# Altium project FPGA_Nixie_Clock.PrjPcb
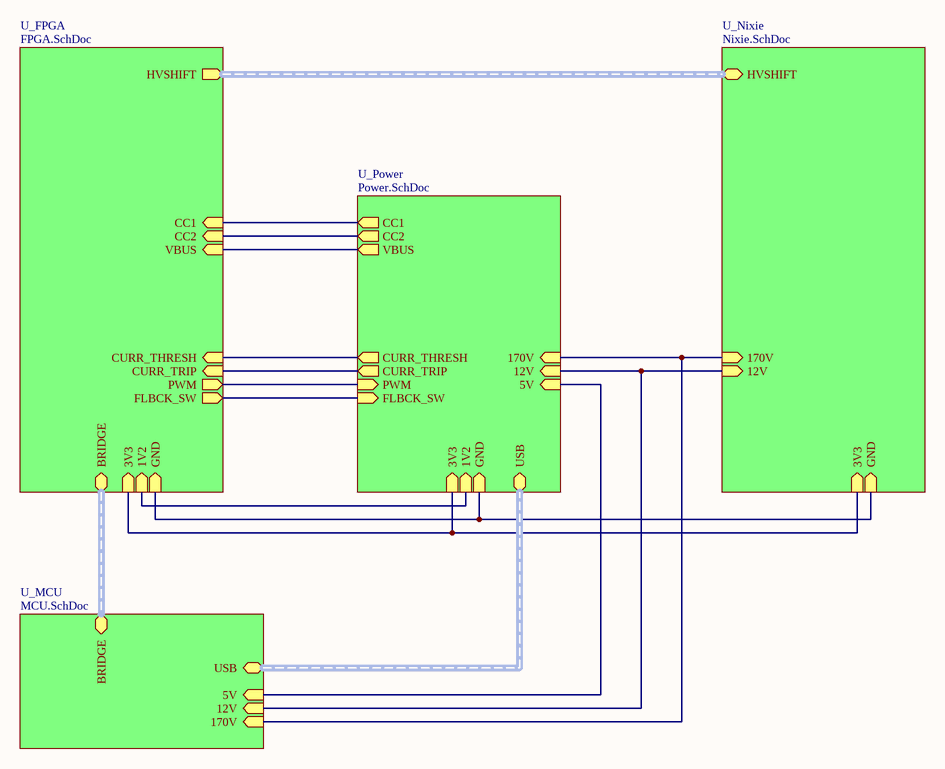
[diagram p0: Top Sheet.SchDoc]
5 sheets, 171 parts. Net scope: hierarchical (ports join the sheet entries above them; power ports are global).
Board file: FPGA_Nixie_Clock.PcbDoc
Sheets:
  Top Sheet.SchDoc
    U_FPGA = FPGA.SchDoc
    U_Power = Power.SchDoc
    U_Nixie = Nixie.SchDoc
    U_MCU = MCU.SchDoc

## Sheet Top Sheet.SchDoc
size A; SheetNumber: 1; SheetTotal: 5

### Sub-sheets
U_FPGA = FPGA.SchDoc: 3V3 (in), GND (in), 1V2 (in), BRIDGE (bidir), FLBCK_SW (out), HVSHIFT (out), CC2 (in), CC1 (in), VBUS (in), CURR_TRIP (in), CURR_THRESH (in), PWM (out)
U_MCU = MCU.SchDoc: BRIDGE (bidir), USB (bidir), 170V (in), 12V (in), 5V (in)
U_Nixie = Nixie.SchDoc: 170V (in), 12V (in), GND (in), 3V3 (in), HVSHIFT (bidir)
U_Power = Power.SchDoc: 3V3 (in), GND (in), 1V2 (in), 170V (in), CURR_TRIP (out), CURR_THRESH (out), PWM (in), 12V (in), USB (bidir), 5V (in), CC2 (out), CC1 (out), VBUS (out), FLBCK_SW (in)

### Nets
3V3: sheet U_FPGA/3V3, sheet U_Power/3V3, sheet U_Nixie/3V3
12V: sheet U_Power/12V, sheet U_Nixie/12V, sheet U_MCU/12V
GND: sheet U_FPGA/GND, sheet U_Power/GND, sheet U_Nixie/GND
VCC_1: sheet U_FPGA/1V2, sheet U_Power/1V2
CC1: sheet U_FPGA/CC1, sheet U_Power/CC1
CC2: sheet U_FPGA/CC2, sheet U_Power/CC2
VBUS: sheet U_FPGA/VBUS, sheet U_Power/5V, sheet U_Power/VBUS, sheet U_MCU/5V
NetC33_2: sheet U_Power/170V, sheet U_Nixie/170V, sheet U_MCU/170V
NetR27_2: sheet U_FPGA/FLBCK_SW, sheet U_Power/FLBCK_SW
NetR35_1: sheet U_FPGA/CURR_THRESH, sheet U_Power/CURR_THRESH
NetU1_45: sheet U_FPGA/PWM, sheet U_Power/PWM
NetU1_48: sheet U_FPGA/CURR_TRIP, sheet U_Power/CURR_TRIP

### Buses and harness runs
harness sheet U_FPGA/BRIDGE = sheet U_MCU/BRIDGE
harness sheet U_FPGA/HVSHIFT = sheet U_Nixie/HVSHIFT
harness sheet U_MCU/USB = sheet U_Power/USB

## Sheet FPGA.SchDoc
size B; SheetNumber: 2; SheetTotal: 5
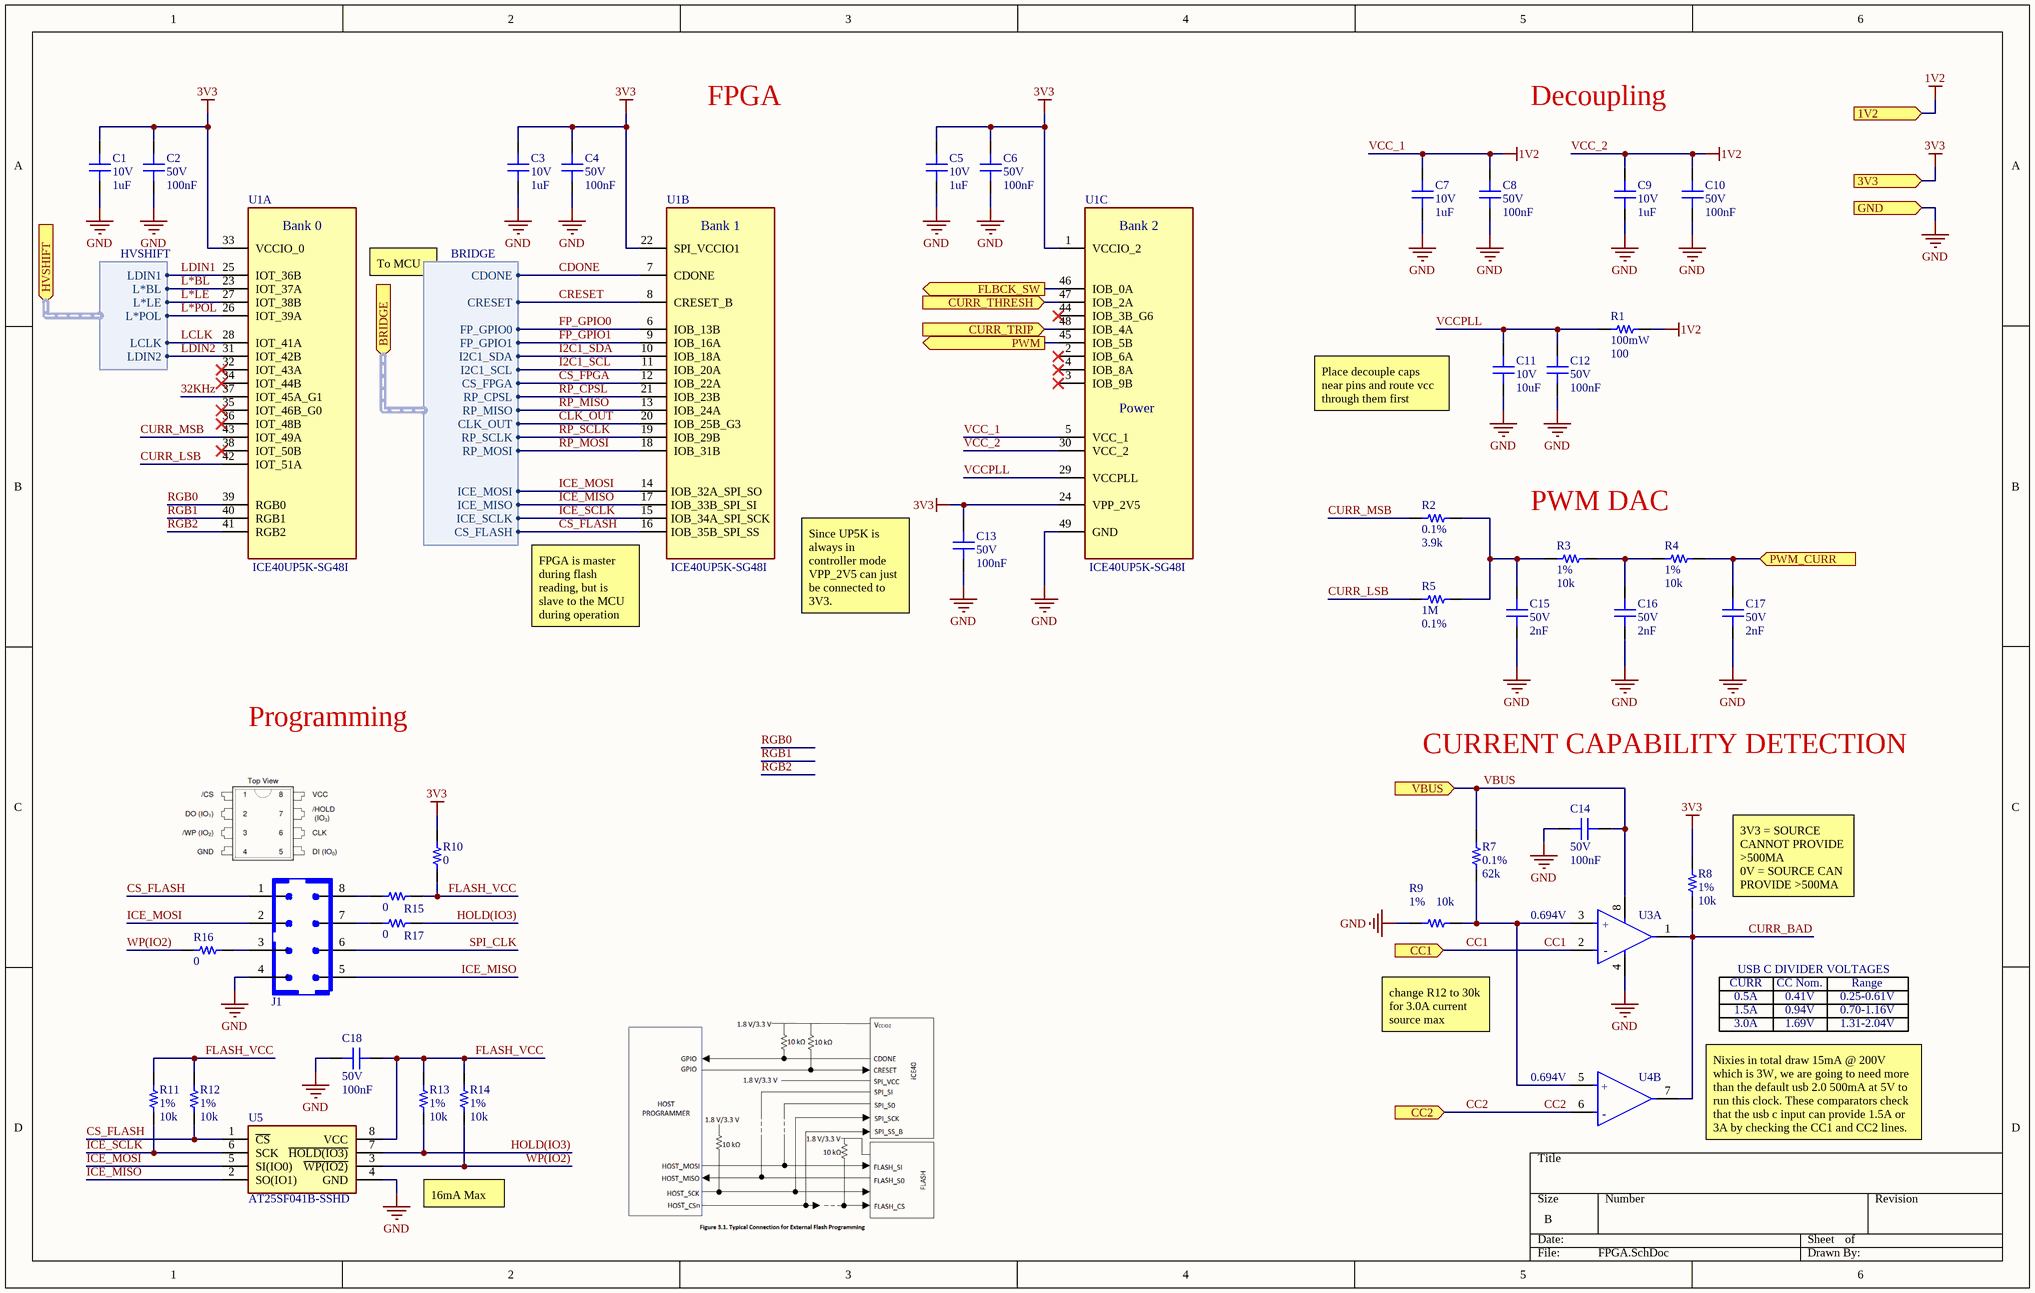
[diagram p1: FPGA.SchDoc]

### Parts
(Parts that share a designator on the sheet are numbered #1, #2 ... from top to bottom, then left to right.)
C1  Voltage Rating: 10V  Capacitance: 1uF  [0603]  (hidden comment: CL10B105KP8NFNC)
C2  Voltage Rating: 50V  Capacitance: 100nF  [0603]  (hidden comment: MT18B104K500CT)
C3  Voltage Rating: 10V  Capacitance: 1uF  [0603]  (hidden comment: CL10B105KP8NFNC)
C4  Voltage Rating: 50V  Capacitance: 100nF  [0603]  (hidden comment: MT18B104K500CT)
C5  Voltage Rating: 10V  Capacitance: 1uF  [0603]  (hidden comment: CL10B105KP8NFNC)
C6  Voltage Rating: 50V  Capacitance: 100nF  [0603]  (hidden comment: MT18B104K500CT)
C7  Voltage Rating: 10V  Capacitance: 1uF  [0603]  (hidden comment: CL10B105KP8NFNC)
C8  Voltage Rating: 50V  Capacitance: 100nF  [0603]  (hidden comment: MT18B104K500CT)
C9  Voltage Rating: 10V  Capacitance: 1uF  [0603]  (hidden comment: CL10B105KP8NFNC)
C10  Voltage Rating: 50V  Capacitance: 100nF  [0603]  (hidden comment: MT18B104K500CT)
C11  Voltage Rating: 10V  Capacitance: 10uF  [0603]  (hidden comment: 0603X106M100CT)
C12  Voltage Rating: 50V  Capacitance: 100nF  [0603]  (hidden comment: MT18B104K500CT)
C13  Voltage Rating: 50V  Capacitance: 100nF  [0603]  (hidden comment: MT18B104K500CT)
C14  Voltage Rating: 50V  Capacitance: 100nF  [0603]  (hidden comment: MT18B104K500CT)
C15  Voltage Rating: 50V  Capacitance: 2nF  [0603]  (hidden comment: GRM1885C1H202JA01D)
C16  Voltage Rating: 50V  Capacitance: 2nF  [0603]  (hidden comment: GRM1885C1H202JA01D)
C17  Voltage Rating: 50V  Capacitance: 2nF  [0603]  (hidden comment: GRM1885C1H202JA01D)
C18  Voltage Rating: 50V  Capacitance: 100nF  [0603]  (hidden comment: MT18B104K500CT)
J1  IDC 2x4 2.54mm DC3-8P  [2.54mm Pitch 1.1mm Drill 2x4P]  (value not drawn)
R1  Power Rating: 100mW  Resistance: 100  [0603]  (hidden comment: CRG0603F100R)
R2  Tolerance: 0.1%  Resistance: 3.9k  [0603]  (hidden comment: CPF0603B3K9E1)
R3  Tolerance: 1%  Resistance: 10k  [0603]  (hidden comment: CRG0603F10K)
R4  Tolerance: 1%  Resistance: 10k  [0603]  (hidden comment: CRG0603F10K)
R5  Resistance: 1M  Tolerance: 0.1%  [0603]  (hidden comment: CPF0603B1M0E)
R7  Tolerance: 0.1%  Resistance: 62k  [0603]  (hidden comment: CPF0603B62KE1)
R8  Tolerance: 1%  Resistance: 10k  [0603]  (hidden comment: CRG0603F10K)
R9  Tolerance: 1%  Resistance: 10k  [0603]  (hidden comment: CRG0603F10K)
R10  Resistance: 0  [0603]  (hidden comment: RC0603JR-070RL)
R11  Tolerance: 1%  Resistance: 10k  [0603]  (hidden comment: CRG0603F10K)
R12  Tolerance: 1%  Resistance: 10k  [0603]  (hidden comment: CRG0603F10K)
R13  Tolerance: 1%  Resistance: 10k  [0603]  (hidden comment: CRG0603F10K)
R14  Tolerance: 1%  Resistance: 10k  [0603]  (hidden comment: CRG0603F10K)
R15  Resistance: 0  [0603]  (hidden comment: RC0603JR-070RL)
R16  Resistance: 0  [0603]  (hidden comment: RC0603JR-070RL)
R17  Resistance: 0  [0603]  (hidden comment: RC0603JR-070RL)
U1  ICE40UP5K-SG48I  [QFN-48]  (parts A,B,C of 3)
U3#1  LM393DR2G  [SOIC-8]  (value not drawn)  (part A of 2)
U4  LM393DR2G  [SOIC-8]  (value not drawn)  (part B of 2)
U5  AT25SF041B-SSHD  [SOIC-8]

### Ports
1V2 (in, see Top Sheet[1C], Power[6B]), 3V3 (in, see Top Sheet[1C], Nixie[1A], Power[6A]), BRIDGE (in, harness BRIDGE, see Top Sheet[1C], MCU[3B]), CC1 (in, see Top Sheet[2A], Power[2A]), CC2 (in, see Top Sheet[2B], Power[2B]), CURR_THRESH (in, see Top Sheet[2B], Power[4D]), CURR_TRIP (in, see Top Sheet[2B], Power[5D]), FLBCK_SW (out, see Top Sheet[2B], Power[1C]), GND (in, see Top Sheet[1C], Nixie[1A], Power[1D]), HVSHIFT (in, harness HVSHIFT, see Top Sheet[2A], Nixie[1C]), PWM (out, see Top Sheet[2B], Power[2D]), PWM_CURR (in), VBUS (in, see Top Sheet[2B], Power[4A])

### Harnesses
BRIDGE: CS_FLASH, ICE_SCLK, ICE_MOSI, ICE_MISO, CDONE, CRESET, CS_FPGA, RP_SCLK, RP_MOSI, RP_MISO, RP_CPSL, CLK_OUT, FP_GPIO1, FP_GPIO0, I2C1_SCL, I2C1_SDA
HVSHIFT: LDIN1, L*BL, L*LE, L*POL, LCLK, LDIN2

### Nets
3V3: C1.2 C2.2 C3.2 C4.2 C5.2 C6.2 C13.2 R8.2 R10.2 U1.1(VCCIO_2) U1.22(SPI_VCCIO1) U1.24(VPP_2V5) U1.33(VCCIO_0) ; port 3V3
GND: C1.1 C2.1 C3.1 C4.1 C5.1 C6.1 C7.1 C8.1 C9.1 C10.1 C11.1 C12.1 C13.1 C14.2 C15.1 C16.1 C17.1 C18.2 J1.4 R9.1 U1.49(GND) U3#1.4(GND) U5.4(GND) ; port GND
VCC_1: C7.2 C8.2 C9.2 C10.2 R1.2 U1.5(VCC_1) U1.30(VCC_2) ; port 1V2  [also labelled 1V2, VCC_2]
32KHz: U1.37(IOT_45A_G1)
CC1: U3#1.2(IN1-) ; port CC1
CC2: U4.6(IN2-) ; port CC2
CDONE: U1.7(CDONE) ; port BRIDGE.CDONE
CLK_OUT: U1.20(IOB_25B_G3) ; port BRIDGE.CLK_OUT  [project net CLK_GPOUT0]
CRESET: U1.8(CRESET_B) ; port BRIDGE.CRESET
CS_FLASH: J1.1 R12.1 U1.16(IOB_35B_SPI_SS) U5.1(~{CS}) ; port BRIDGE.CS_FLASH
CS_FPGA: U1.12(IOB_22A) ; port BRIDGE.CS_FPGA
CURR_BAD: R8.1 U3#1.1(OUT1) U4.7(OUT2)
CURR_LSB: R5.1 U1.42(IOT_51A)
CURR_MSB: R2.1 U1.43(IOT_49A)
FLASH_VCC: C18.1 R10.1 R11.2 R12.2 R13.2 R14.2 R15.2 U5.8(VCC)
FP_GPIO0: U1.6(IOB_13B) ; port BRIDGE.FP_GPIO0
FP_GPIO1: U1.9(IOB_16A) ; port BRIDGE.FP_GPIO1
HOLD(IO3): R13.1 R17.2 U5.7(~{HOLD(IO3)})
I2C1_SCL: U1.11(IOB_20A) ; port BRIDGE.I2C1_SCL
I2C1_SDA: U1.10(IOB_18A) ; port BRIDGE.I2C1_SDA
ICE_MISO: J1.5 U1.17(IOB_33B_SPI_SI) U5.2(SO(IO1)) ; port BRIDGE.ICE_MISO
ICE_MOSI: J1.2 U1.14(IOB_32A_SPI_SO) U5.5(SI(IO0)) ; port BRIDGE.ICE_MOSI
ICE_SCLK: R11.1 U1.15(IOB_34A_SPI_SCK) U5.6(SCK) ; port BRIDGE.ICE_SCLK
L*BL: U1.23(IOT_37A) ; port HVSHIFT.L*BL
L*LE: U1.27(IOT_38B) ; port HVSHIFT.L*LE
L*POL: U1.26(IOT_39A) ; port HVSHIFT.L*POL
LCLK: U1.28(IOT_41A) ; port HVSHIFT.LCLK
LDIN1: U1.25(IOT_36B) ; port HVSHIFT.LDIN1
LDIN2: U1.31(IOT_42B) ; port HVSHIFT.LDIN2
RGB0: U1.39(RGB0)
RGB1: U1.40(RGB1)
RGB2: U1.41(RGB2)
RP_CPSL: U1.21(IOB_23B) ; port BRIDGE.RP_CPSL
RP_MISO: U1.13(IOB_24A) ; port BRIDGE.RP_MISO
RP_MOSI: U1.18(IOB_31B) ; port BRIDGE.RP_MOSI
RP_SCLK: U1.19(IOB_29B) ; port BRIDGE.RP_SCLK
SPI_CLK: J1.6
VBUS: C14.1 R7.2 U3#1.8(V+) ; port VBUS
VCCPLL: C11.2 C12.2 R1.1 U1.29(VCCPLL)
WP(IO2): R14.1 R16.1 U5.3(~{WP(IO2)})
NetC15_2: C15.2 R2.2 R3.2 R5.2
NetC16_2: C16.2 R3.1 R4.2
NetC17_2: C17.2 R4.1 ; port PWM_CURR
NetJ1_3: J1.3 R16.2
NetJ1_7: J1.7 R17.1
NetJ1_8: J1.8 R15.1
NetR7_1: R7.1 R9.2 U3#1.3(IN1+) U4.5(IN2+)
NetR27_2: U1.46(IOB_0A) ; port FLBCK_SW
NetR35_1: U1.47(IOB_2A) ; port CURR_THRESH
NetU1_45: U1.45(IOB_5B) ; port PWM
NetU1_48: U1.48(IOB_4A) ; port CURR_TRIP

Not connected (* = marked no-connect by the designer): U1 2(IOB_6A)* 3(IOB_9B)* 4(IOB_8A)* 32(IOT_43A)* 34(IOT_44B)* 35(IOT_46B_G0)* 36(IOT_48B)* 38(IOT_50B)* 44(IOB_3B_G6)*

### Notes on the sheet
- FPGA
- Decoupling
- To MCU
- Place decouple caps near pins and route vcc through them first
- PWM DAC
- (near U1) FPGA is master during flash reading, but is slave to the MCU during operation
- Since UP5K is always in controller mode VPP_2V5 can just be connected to 3V3.
- Programming
- CURRENT CAPABILITY DETECTION
- (near R8) 3V3 = SOURCE CANNOT PROVIDE >500MA
  0V = SOURCE CAN PROVIDE >500MA
- (near U3#1) 0.694V
- USB C DIVIDER VOLTAGES
- change R12 to 30k for 3.0A current source max
- CURR
- 0.5A
- 1.5A
- 3.0A
- CC Nom.
- 0.41V
- 0.94V
- 1.69V
- Range
- 0.25-0.61V
- 0.70-1.16V
- 1.31-2.04V
- (near U4) 0.694V
- Nixies in total draw 15mA @ 200V which is 3W, we are going to need more than the default usb 2.0 500mA at 5V to run this clock. These comparators check that the usb c input can provide 1.5A or 3A by checking the CC1 and CC2 lines.
- 16mA Max
- (in symbol ICE40UP5K-SG48I, part A) Bank 0
- (in symbol ICE40UP5K-SG48I, part B) Bank 1
- (in symbol ICE40UP5K-SG48I, part C) Bank 2; Power
- (in symbol LM393DR2G, part A) +; -
- (in symbol LM393DR2G, part B) +; -

### Library data of the parts
C1 C3 C5 C7 C9 = CL10B105KP8NFNC: 1 µF ±10% 10V Ceramic Capacitor X7R 0603 (1608 Metric); Dielectric: X7R; Tolerance: 10%
C2 C4 C6 C8 C10 C12-C14 C18 = MT18B104K500CT: 0.1 µF ±10% 50V Ceramic Capacitor X7R 0603 (1608 Metric); Dielectric: X7R; Tolerance: 10%
C11 = 0603X106M100CT: 10 µF ±20% 10V Ceramic Capacitor X5R 0603 (1608 Metric); Dielectric: X5R; Tolerance: 20%
C15-C17 = GRM1885C1H202JA01D: 2000 pF ±5% 50V Ceramic Capacitor C0G, NP0 0603 (1608 Metric); Dielectric: C0G (NP0); Tolerance: 5%
J1 = IDC 2x4 2.54mm DC3-8P: Straight idc box headers PCB CONNECTOR DOUBLE ROW DC3 HEADER; M/F: Male; Rows: 2; Pins: 8; Pitch: 2.54mm
R1 = CRG0603F100R: 100 Ohms ±1% 0.1W, 1/10W Chip Resistor 0603 (1608 Metric) Thick Film; Temperature Coefficient: 100ppm/c; Tolerance: 1%; Case Code: 0603
R2 = CPF0603B3K9E1: 3.9 kOhms ±0.1% 0.063W, 1/16W Chip Resistor 0603 (1608 Metric) Thin Film; Power Rating: 62.5mW; Temperature Coefficient: 25ppm/c; Case Code: 0603
R3 R4 R8 R9 R11-R14 = CRG0603F10K: 10 kOhms ±1% 0.1W, 1/10W Chip Resistor 0603 (1608 Metric) Thick Film; Power Rating: 100mW; Temperature Coefficient: 100ppm/c; Case Code: 0603
R5 = CPF0603B1M0E: 1 MOhms ±0.1% 0.063W, 1/16W Chip Resistor 0603 (1608 Metric) Thin Film; Power Rating: 62.5mW; Temperature Coefficient: 25ppm/c; Case Code: 0603
R7 = CPF0603B62KE1: 62 kOhms ±0.1% 0.063W, 1/16W Chip Resistor 0603 (1608 Metric) Thin Film; Power Rating: 62.5mW; Temperature Coefficient: 25ppm/c; Case Code: 0603
R10 R15-R17 = RC0603JR-070RL: 0 Ohms Jumper 0.1W, 1/10W Chip Resistor 0603 (1608 Metric) Moisture Resistant Thick Film; Temperature Coefficient: 0ppm/c; Tolerance: 0%; Power Rating: 100mW; Case Code: 0603
U1 = ICE40UP5K-SG48I: FPGA - Field Programmable Gate Array iCE40-UltraPlus, 5280 LUTs, 1.2V
U3#1 U4 = LM393DR2G: Comparator Standard (General Purpose) Open-Collector, Rail-to-Rail 8-SOIC
U5 = AT25SF041B-SSHD: FLASH - NOR Memory IC 4Mbit SPI - Quad I/O 108 MHz 8-SOIC

## Sheet Power.SchDoc
size B; SheetNumber: 3; SheetTotal: 5
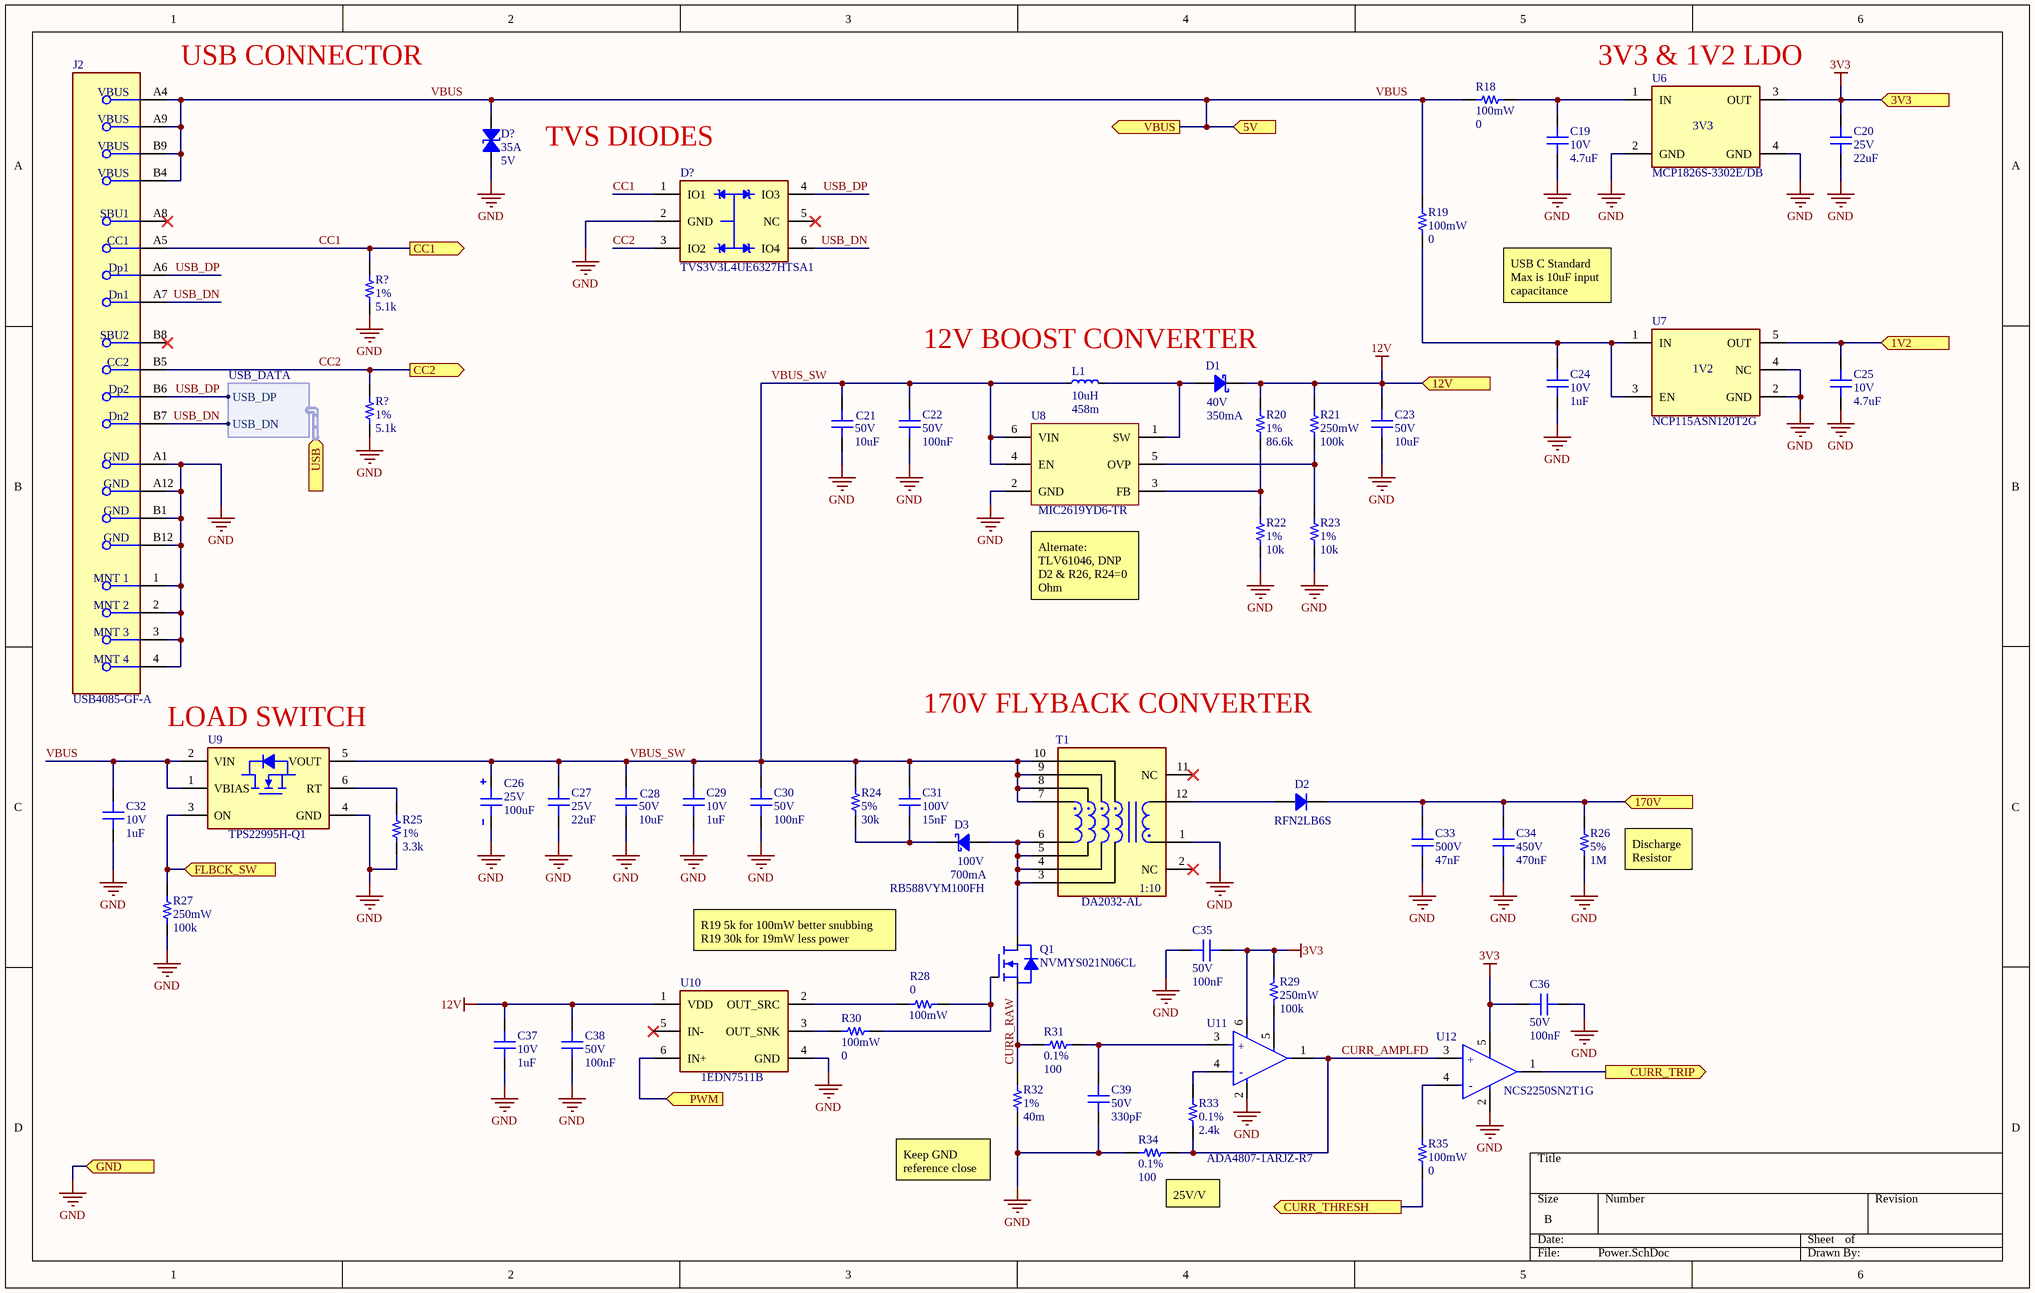
[diagram p2: Power.SchDoc]

### Parts
(Parts that share a designator on the sheet are numbered #1, #2 ... from top to bottom, then left to right.)
C19  Voltage Rating: 10V  Capacitance: 4.7uF  [0603]  (hidden comment: CL10A475KP8NNNC)
C20  Voltage Rating: 25V  Capacitance: 22uF  [0805]  (hidden comment: GRM21BR61E226ME44K)
C21  Voltage Rating: 50V  Capacitance: 10uF  [0805]  (hidden comment: GRM21BR61H106KE43L)
C22  Voltage Rating: 50V  Capacitance: 100nF  [0603]  (hidden comment: MT18B104K500CT)
C23  Voltage Rating: 50V  Capacitance: 10uF  [0805]  (hidden comment: GRM21BR61H106KE43L)
C24  Voltage Rating: 10V  Capacitance: 1uF  [0603]  (hidden comment: CL10B105KP8NFNC)
C25  Voltage Rating: 10V  Capacitance: 4.7uF  [0603]  (hidden comment: CL10A475KP8NNNC)
C26  Voltage Rating: 25V  Capacitance: 100uF  [0608]  (hidden comment: EHBSA025M1010608T)
C27  Voltage Rating: 25V  Capacitance: 22uF  [0805]  (hidden comment: GRM21BR61E226ME44K)
C28  Voltage Rating: 50V  Capacitance: 10uF  [0805]  (hidden comment: GRM21BR61H106KE43L)
C29  Voltage Rating: 10V  Capacitance: 1uF  [0603]  (hidden comment: CL10B105KP8NFNC)
C30  Voltage Rating: 50V  Capacitance: 100nF  [0603]  (hidden comment: MT18B104K500CT)
C31  Voltage Rating: 100V  Capacitance: 15nF  [0805]  (hidden comment: GRM2165C2A153JA01D)
C32  Voltage Rating: 10V  Capacitance: 1uF  [0603]  (hidden comment: CL10B105KP8NFNC)
C33  Voltage Rating: 500V  Capacitance: 47nF  [1206]  (hidden comment: VJ1206Y473KXEAT5Z)
C34  Voltage Rating: 450V  Capacitance: 470nF  [15mm Film Capacitor]  (hidden comment: ECW-FD2W474K)
C35  Voltage Rating: 50V  Capacitance: 100nF  [0603]  (hidden comment: MT18B104K500CT)
C36  Voltage Rating: 50V  Capacitance: 100nF  [0603]  (hidden comment: MT18B104K500CT)
C37  Voltage Rating: 10V  Capacitance: 1uF  [0603]  (hidden comment: CL10B105KP8NFNC)
C38  Voltage Rating: 50V  Capacitance: 100nF  [0603]  (hidden comment: MT18B104K500CT)
C39  Voltage Rating: 50V  Capacitance: 330pF  [0603]  (hidden comment: VJ0603A331FXACW1BC)
D1  Reverse Voltage: 40V  Average Current: 350mA  [SOD-323]  (hidden comment: SD103AWS-G3-08)
D2  RFN2LB6S  [DO-214AA]
D3  RB588VYM100FH  Reverse Voltage: 100V  Average Current: 700mA  [SOD-323HE]
D?#1  Peak Current: 35A  VWM: 5V  [SOD-323]  (hidden comment: STS321050B331AH)
D?#2  TVS3V3L4UE6327HTSA1  [SOT-23-6]
J2  USB4085-GF-A  [FP-USB4085-GF-A-MFG]
L1  Resistance: 458m  Inductance: 10uH  [SD3114 Series]  (hidden comment: SD3114-100-R)
Q1  NVMYS021N06CL  [LFPAK-4]
R18  Power Rating: 100mW  Resistance: 0  [0603]  (hidden comment: RC0603JR-070RL)
R19  Power Rating: 100mW  Resistance: 0  [0603]  (hidden comment: RC0603JR-070RL)
R20  Tolerance: 1%  Resistance: 86.6k  [0603]  (hidden comment: CRCW060386K6FKEA)
R21  Power Rating: 250mW  Resistance: 100k  [0603]  (hidden comment: CRGP0603F100K)
R22  Tolerance: 1%  Resistance: 10k  [0603]  (hidden comment: CRG0603F10K)
R23  Tolerance: 1%  Resistance: 10k  [0603]  (hidden comment: CRG0603F10K)
R24  Tolerance: 5%  Resistance: 30k  [1206]  (hidden comment: ERJ-P08J303V)
R25  Tolerance: 1%  Resistance: 3.3k  [0603]  (hidden comment: CRGCQ0603F3K3)
R26  Tolerance: 5%  Resistance: 1M  [1206]  (hidden comment: CRG1206F1M0)
R27  Power Rating: 250mW  Resistance: 100k  [0603]  (hidden comment: CRGP0603F100K)
R28  Power Rating: 100mW  Resistance: 0  [0603]  (hidden comment: RC0603JR-070RL)
R29  Power Rating: 250mW  Resistance: 100k  [0603]  (hidden comment: CRGP0603F100K)
R30  Power Rating: 100mW  Resistance: 0  [0603]  (hidden comment: RC0603JR-070RL)
R31  Tolerance: 0.1%  Resistance: 100  [0603]  (hidden comment: CPF0603B100RE1)
R32  Tolerance: 1%  Resistance: 40m  [1206]  (hidden comment: TLRP2B10WR040FTD)
R33  Tolerance: 0.1%  Resistance: 2.4k  [0603]  (hidden comment: CPF0603B2K4E1)
R34  Tolerance: 0.1%  Resistance: 100  [0603]  (hidden comment: CPF0603B100RE1)
R35  Power Rating: 100mW  Resistance: 0  [0603]  (hidden comment: RC0603JR-070RL)
R?#1  Tolerance: 1%  Resistance: 5.1k  [0805]  (hidden comment: CRG0805F5K1)
R?#2  Tolerance: 1%  Resistance: 5.1k  [0805]  (hidden comment: CRG0805F5K1)
T1  DA2032-AL  [DA2032-AL]
U6#1  MCP1826S-3302E/DB  [SOT-223-3]
U7  NCP115ASN120T2G  [SOT-23-5]
U8#1  MIC2619YD6-TR  [SOT-23-6]
U9  TPS22995H-Q1  [SOT-23-6]
U10  1EDN7511B  [SOT-23-6]
U11  ADA4807-1ARJZ-R7  [SOT-23-6]
U12  NCS2250SN2T1G  [SOT-23-5]

### Ports
1V2 (in, see Top Sheet[2C], FPGA[6A]), 3V3 (in, see Top Sheet[2C], FPGA[6A], Nixie[1A]), 5V (in, see Top Sheet[3B], MCU[5C]), 12V (in, see Top Sheet[3B], MCU[5C]), 170V (in, see Top Sheet[3B], MCU[5C]), CC1 (out, see Top Sheet[2A], FPGA[5C]), CC2 (out, see Top Sheet[2B], FPGA[5D]), CURR_THRESH (out, see Top Sheet[2B], FPGA[3A]), CURR_TRIP (out, see Top Sheet[2B], FPGA[3B]), FLBCK_SW (in, see Top Sheet[2B], FPGA[3A]), GND (in, see Top Sheet[2C], FPGA[6A], Nixie[1A]), PWM (in, see Top Sheet[2B], FPGA[3B]), USB (in, harness USB_DATA, see Top Sheet[3C], MCU[3A]), VBUS (out, see Top Sheet[2B], FPGA[5C])

### Harnesses
USB_DATA: USB_DP, USB_DN

### Nets
3V3: C20.2 C35.1 C36.1 R29.2 U6#1.3(OUT) U11.6(V+) U12.5(VDD) ; port 3V3
12V: C23.2 C37.2 C38.1 D1.1(Cathode) R20.2 R21.2 U10.1(VDD) ; port 12V
GND: C19.1 C20.1 C21.1 C22.2 C23.1 C24.1 C25.1 C26.1 C27.1 C28.1 C29.1 C30.2 C32.1 C33.1 C34.1 C35.2 C36.2 C37.1 C38.2 C39.1 D?#1.1 D?#2.2(GND) J2.1(MNT_1) J2.2(MNT_2) J2.3(MNT_3) J2.4(MNT_4) J2.A1(GND) J2.A12(GND) J2.B1(GND) J2.B12(GND) R22.1 R23.1 R25.1 R26.1 R27.1 R32.1 R34.1 R?#1.1 R?#2.1 T1.1 U6#1.2(GND) U6#1.4(GND) U7.2(GND) U7.4(NC) U8#1.2(GND) U9.4(GND) U10.4(GND) U11.2(VS-) U12.2(VSS) ; port GND
VCC_1: C25.2 U7.5(OUT) ; port 1V2
CC1: D?#2.1(IO1) J2.A5(CC1) R?#1.2 ; port CC1
CC2: D?#2.3(IO2) J2.B5(CC2) R?#2.2 ; port CC2
CURR_AMPLFD: R33.1 R34.2 U11.1(OUT1) U12.3(IN1+)
CURR_RAW: Q1.1(S) R31.1 R32.2
USB_DN: D?#2.6(IO4) J2.A7(Dn1) J2.B7(Dn2) ; port USB.USB_DN
USB_DP: D?#2.4(IO3) J2.A6(Dp1) J2.B6(Dp2) ; port USB.USB_DP
VBUS: C32.2 D?#1.2 J2.A4(VBUS) J2.A9(VBUS) J2.B4(VBUS) J2.B9(VBUS) R18.2 R19.2 U9.1(VBIAS) U9.2(VIN) ; port 5V, port VBUS
VBUS_SW: C21.2 C22.1 C26.2 C27.2 C28.2 C29.2 C30.1 C31.2 L1.1 R24.2 T1.7 T1.8 T1.9 T1.10 U8#1.4(EN) U8#1.6(VIN) U9.5(VOUT)
NetC19_2: C19.2 R18.1 U6#1.1(IN)
NetC24_2: C24.2 R19.1 U7.1(IN) U7.3(EN)
NetC31_1: C31.1 D3.1(Cathode) R24.1
NetC33_2: C33.2 C34.2 D2.1(Cathode) R26.2 ; port 170V
NetC39_2: C39.2 R31.2 U11.3(IN1+)
NetD1_2: D1.2(Anode) L1.2 U8#1.1(SW)
NetD2_2: D2.2(Anode) T1.12
NetD3_2: D3.2(Anode) Q1.5(D) T1.3 T1.4 T1.5 T1.6
NetQ1_4: Q1.4(G) R28.2 R30.2
NetR20_1: R20.1 R22.2 U8#1.3(FB)
NetR21_1: R21.1 R23.2 U8#1.5(OVP)
NetR25_2: R25.2 U9.6(RT)
NetR27_2: R27.2 U9.3(ON) ; port FLBCK_SW
NetR28_1: R28.1 U10.2(OUT_SRC)
NetR29_1: R29.1 U11.5(!DISABLE)
NetR30_1: R30.1 U10.3(OUT_SNK)
NetR33_2: R33.2 U11.4(IN1-)
NetR35_1: R35.1 ; port CURR_THRESH
NetR35_2: R35.2 U12.4(IN1-)
NetU1_45: U10.6(IN+) ; port PWM
NetU1_48: U12.1(OUT1) ; port CURR_TRIP

Not connected (* = marked no-connect by the designer): D?#2 5(NC)*; J2 A8(SBU1)* B8(SBU2)*; Q1 2(S) 3(S) 6(D) 7(D) 8(D); T1 2(NC)* 11(NC)*; U10 5(IN-)*

### Notes on the sheet
- (near J2) USB CONNECTOR
- (near U6#1) 3V3 & 1V2 LDO
- (near D?#2) TVS DIODES
- USB C Standard Max is 10uF input capacitance
- 12V BOOST CONVERTER
- (near U8#1) Alternate: TLV61046, DNP D2 & R26, R24=0 Ohm
- LOAD SWITCH
- (near T1) 170V FLYBACK CONVERTER
- (near R26) Discharge Resistor
- R19 5k for 100mW better snubbing
  R19 30k for 19mW less power
- (near R32) Keep GND reference close
- (near R34) 25V/V
- (in symbol ADA4807-1ARJZ-R7) +; -
- (in symbol DA2032-AL) 1:10
- (in symbol MCP1826S-3302E/DB) 3V3
- (in symbol NCP115ASN120T2G) 1V2
- (in symbol NCS2250SN2T1G) +; -

### Library data of the parts
C19 C25 = CL10A475KP8NNNC: 4.7 µF ±10% 10V Ceramic Capacitor X5R 0603 (1608 Metric); Dielectric: X5R; Tolerance: 10%
C20 C27 = GRM21BR61E226ME44K: 22 µF ±20% 25V Ceramic Capacitor X5R 0805 (2012 Metric); Dielectric: X5R; Tolerance: 20%
C21 C23 C28 = GRM21BR61H106KE43L: 10 µF ±10% 50V Ceramic Capacitor X5R 0805 (2012 Metric); Dielectric: X5R; Tolerance: 10%
C22 C30 C35 C36 C38 = MT18B104K500CT: as C2 on sheet FPGA; Dielectric: X7R; Tolerance: 10%
C24 C29 C32 C37 = CL10B105KP8NFNC: as C1 on sheet FPGA; Dielectric: X7R; Tolerance: 10%
C26 = EHBSA025M1010608T: 100 µF 25 V Aluminum - Polymer Capacitors Radial, Can - SMD 30mOhm 4000 Hrs @ 125°C; Dielectric: AOP; Tolerance: 20%
C31 = GRM2165C2A153JA01D: 0.015 µF ±5% 100V Ceramic Capacitor C0G, NP0 0805 (2012 Metric); Dielectric: C0G (NP0); Tolerance: 5%
C33 = VJ1206Y473KXEAT5Z: Multilayer Ceramic Capacitors MLCC - SMD/SMT 1206 .047uF 500volts X7R 10%; Dielectric: X7R; Tolerance: 10%
C34 = ECW-FD2W474K: 0.47 µF Film Capacitor 450V Polypropylene (PP), Metallized Radial; Tolerance: 10%; Dielectric: PP
C39 = VJ0603A331FXACW1BC: 330 pF ±1% 50V Ceramic Capacitor C0G, NP0 0603 (1608 Metric); Dielectric: C0G (NP0); Tolerance: 1%
D1 = SD103AWS-G3-08: Diode 40 V 350mA Surface Mount SOD-323; Type: Schottky; Package: SOD-323
D2 = RFN2LB6S: Diode 600 V 2A Surface Mount SMBP; Reverse Voltage: 600V; Type: Fast Recovery; Average Current: 2A; Package: DO-214AA
D3 = RB588VYM100FH: Diode 100 V 700mA Surface Mount TUMD2M (SOD-323HE); Type: Schottky; Package: SOD-323HE
D?#1 = STS321050B331AH: 14V Clamp 35A (8/20µs) Ipp Tvs Diode Surface Mount SOD-323; Package: SOD-323; Reverse Voltage: 14V; Type: TVS
D?#2 = TVS3V3L4UE6327HTSA1: 7.7V (Typ) Clamp 20A (8/20µs) Ipp Tvs Diode Surface Mount PG-SC74-6; VWM: 3.3V; Package: SOT-23-6; Reverse Voltage: 7.7 V; Type: TVS
J2 = USB4085-GF-A: USB-C USB 2.0 Receptacle
L1 = SD3114-100-R: 10 µH Shielded Drum Core, Wirewound Inductor 570 mA 458mOhm Nonstandard; Avg Current: 570mA; Sat Current: 780mA
Q1 = NVMYS021N06CL: N-Channel 60 V 9.8A (Ta), 27A (Tc) 3.8W (Ta), 28W (Tc) Surface Mount LFPAK4 (5x6)
R18 R19 R28 R30 R35 = RC0603JR-070RL: 0 Ohms Jumper 0.1W, 1/10W Chip Resistor 0603 (1608 Metric) Moisture Resistant Thick Film; Temperature Coefficient: 0ppm/c; Tolerance: 0%; Case Code: 0603
R20 = CRCW060386K6FKEA: 86.6 kOhms ±1% 0.125W, 1/8W Chip Resistor 0603 (1608 Metric) Automotive AEC-Q200 Thick Film; Power Rating: 125mW; Temperature Coefficient: 200ppm/c; Case Code: 0603
R21 R27 R29 = CRGP0603F100K: 100 kOhms ±1% 0.25W, 1/4W Chip Resistor 0603 (1608 Metric) Automotive AEC-Q200, Pulse Withstanding Thick Film; Temperature Coefficient: 100ppm/c; Case Code: 0603; Tolerance: 1%
R22 R23 = CRG0603F10K: as R3 on sheet FPGA; Case Code: 0603
R24 = ERJ-P08J303V: 30 kOhms ±5% 0.667W, 2/3W Chip Resistor 1206 (3216 Metric) Automotive AEC-Q200, Pulse Withstanding Thick Film; Power Rating: 667mW; Temperature Coefficient: 200ppm/c; Case Code: 1206
R25 = CRGCQ0603F3K3: 3.3 kOhms ±1% 0.1W, 1/10W Chip Resistor 0603 (1608 Metric) Automotive AEC-Q200, Moisture Resistant Thick Film; Power Rating: 100mW; Temperature Coefficient: 100ppm/c; Case Code: 0603
R26 = CRG1206F1M0: 1 MOhms ±1% 0.25W, 1/4W Chip Resistor 1206 (3216 Metric) Thick Film; Power Rating: 250mW; Temperature Coefficient: 200ppm/c; Case Code: 1206
R31 R34 = CPF0603B100RE1: 100 Ohms ±0.1% 0.063W, 1/16W Chip Resistor 0603 (1608 Metric) Thin Film; Power Rating: 62.5mW; Temperature Coefficient: 25ppm/c; Case Code: 0603
R32 = TLRP2B10WR040FTD: 40 mOhms ±1% 1W Chip Resistor 1206 (3216 Metric) Anti-Sulfur, Automotive AEC-Q200, Current Sense Metal Element; Temperature Coefficient: 75ppm/c; Power Rating: 1W; Case Code: 1206
R33 = CPF0603B2K4E1: 2.4 kOhms ±0.1% 0.063W, 1/16W Chip Resistor 0603 (1608 Metric) Thin Film; Power Rating: 62.5mW; Temperature Coefficient: 25ppm/c; Case Code: 0603
R?#1 R?#2 = CRG0805F5K1: 5.1 kOhms ±1% 0.125W, 1/8W Chip Resistor 0805 (2012 Metric) Thick Film; Power Rating: 125mW; Temperature Coefficient: 100ppm/c; Case Code: 0805
T1 = DA2032-AL: 10 µH ±10% 1:10 Flyback Transformer Surface Mount Ferrite Core 3A Peak, 3–24V Input
U6#1 = MCP1826S-3302E/DB: Linear Voltage Regulator IC Positive Fixed 1 Output 1A SOT-223-3
U7 = NCP115ASN120T2G: Linear Voltage Regulator IC Positive Fixed 1 Output 300mA 5-TSOP
U8#1 = MIC2619YD6-TR: Boost Switching Regulator IC Positive Adjustable 2.8V 1 Output 350mA (Switch) SOT-23-6 Thin, TSOT-23-6
U9 = TPS22995H-Q1: Power Switch/Driver 1:1 N-Channel 3A SOT-23-THIN
U10 = 1EDN7511B: Low-Side Gate Driver IC Inverting, Non-Inverting PG-SOT23-6-2
U11 = ADA4807-1ARJZ-R7: Voltage Feedback Amplifier 1 Circuit Rail-to-Rail SOT-23-6
U12 = NCS2250SN2T1G: Comparator Standard (General Purpose) Push-Pull, Rail-to-Rail 5-TSOP

## Sheet Nixie.SchDoc
size B; SheetNumber: 4; SheetTotal: 5
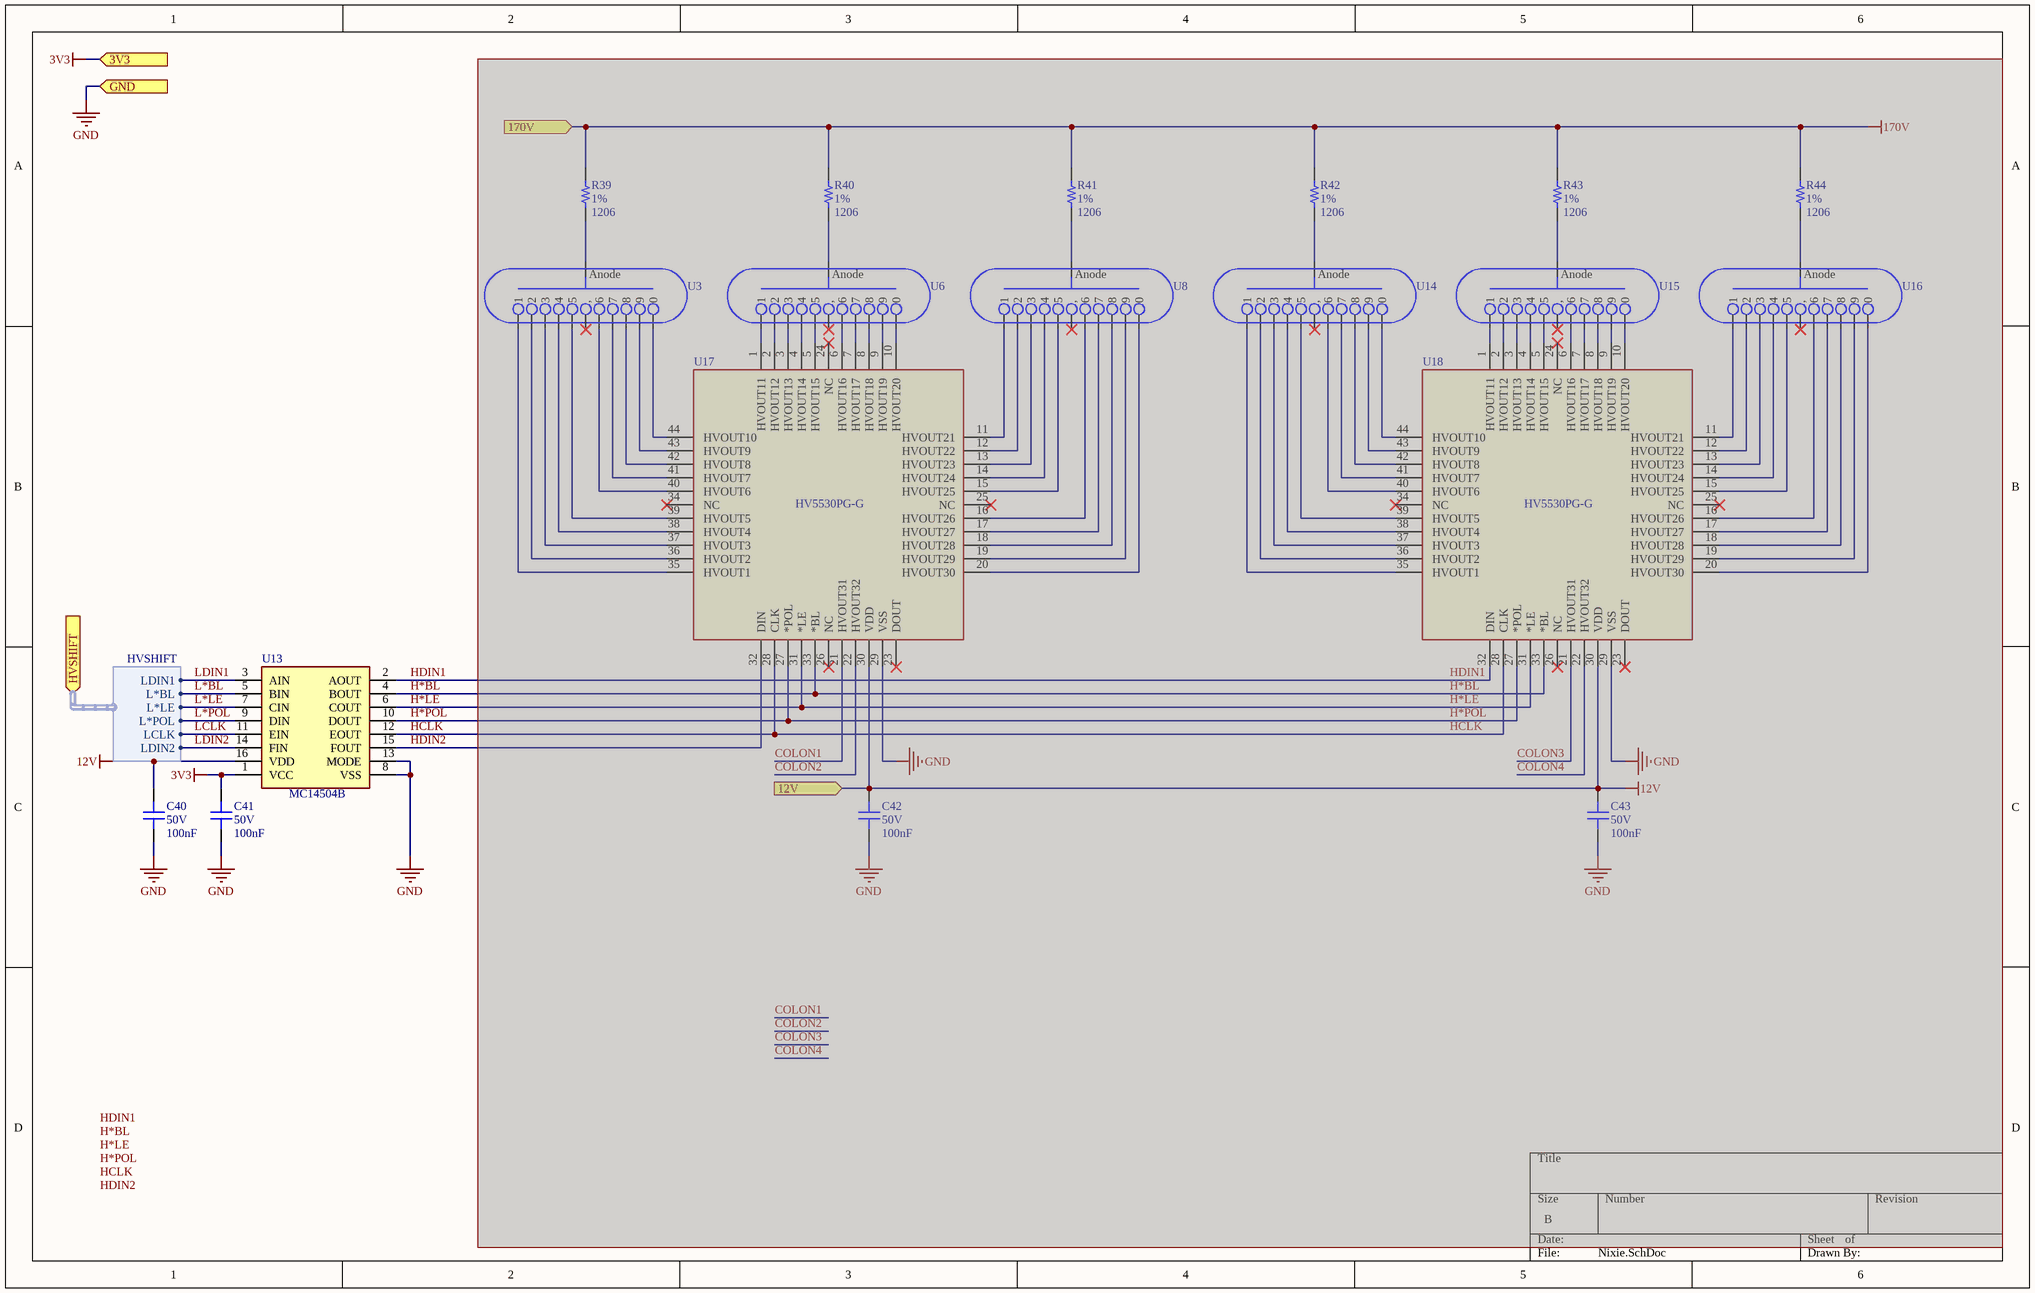
[diagram p3: Nixie.SchDoc]

### Parts
(Parts that share a designator on the sheet are numbered #1, #2 ... from top to bottom, then left to right.)
C40  Voltage Rating: 50V  Capacitance: 100nF  [0603]  (hidden comment: MT18B104K500CT)
C41  Voltage Rating: 50V  Capacitance: 100nF  [0603]  (hidden comment: MT18B104K500CT)
C42#1  Voltage Rating: 50V  Capacitance: 100nF  [0603]  (hidden comment: MT18B104K500CT)  (masked out: inside a compile mask, not in the netlist)
C43#1  Voltage Rating: 50V  Capacitance: 100nF  [0603]  (hidden comment: MT18B104K500CT)  (masked out: inside a compile mask, not in the netlist)
R39#1  Tolerance: 1%  [1206]  (hidden comment: CRGP1206F15K)  (masked out: inside a compile mask, not in the netlist)
R40#1  Tolerance: 1%  [1206]  (hidden comment: CRGP1206F15K)  (masked out: inside a compile mask, not in the netlist)
R41#1  Tolerance: 1%  [1206]  (hidden comment: CRGP1206F15K)  (masked out: inside a compile mask, not in the netlist)
R42  Tolerance: 1%  [1206]  (hidden comment: CRGP1206F15K)  (masked out: inside a compile mask, not in the netlist)
R43#1  Tolerance: 1%  [1206]  (hidden comment: CRGP1206F15K)  (masked out: inside a compile mask, not in the netlist)
R44#1  Tolerance: 1%  [1206]  (hidden comment: CRGP1206F15K)  (masked out: inside a compile mask, not in the netlist)
U3#2  IN-12B  [IN-12B]  (value not drawn)  (masked out: inside a compile mask, not in the netlist)
U6#2  IN-12B  [IN-12B]  (value not drawn)  (masked out: inside a compile mask, not in the netlist)
U8#2  IN-12B  [IN-12B]  (value not drawn)  (masked out: inside a compile mask, not in the netlist)
U13  MC14504B  [SOIC-16]
U14#1  IN-12B  [IN-12B]  (value not drawn)  (masked out: inside a compile mask, not in the netlist)
U15#1  IN-12B  [IN-12B]  (value not drawn)  (masked out: inside a compile mask, not in the netlist)
U16#1  IN-12B  [IN-12B]  (value not drawn)  (masked out: inside a compile mask, not in the netlist)
U17  HV5530PG-G  [PQFP-44]  (masked out: inside a compile mask, not in the netlist)
U18  HV5530PG-G  [PQFP-44]  (masked out: inside a compile mask, not in the netlist)

### Ports
3V3 (in, see Top Sheet[4C], FPGA[6A], Power[6A]), 12V (in, see Top Sheet[3B], MCU[5C], Power[4A]), 170V (in, see Top Sheet[3B], MCU[5C], Power[5C]), GND (in, see Top Sheet[4C], FPGA[6A], Power[1D]), HVSHIFT (in, harness HVSHIFT, see Top Sheet[3A], FPGA[1A])

### Harnesses
HVSHIFT: LDIN1, L*BL, L*LE, L*POL, LCLK, LDIN2

### Nets
3V3: C41.1 U13.1(VCC) ; port 3V3
12V: C40.1 U13.16(VDD)
GND: C40.2 C41.2 U13.8(VSS) U13.13(MODE) ; port GND
H*BL: U13.4(BOUT)
H*LE: U13.6(COUT)
H*POL: U13.10(DOUT)
HCLK: U13.12(EOUT)
HDIN1: U13.2(AOUT)
HDIN2: U13.15(FOUT)
L*BL: U13.5(BIN) ; port HVSHIFT.L*BL
L*LE: U13.7(CIN) ; port HVSHIFT.L*LE
L*POL: U13.9(DIN) ; port HVSHIFT.L*POL
LCLK: U13.11(EIN) ; port HVSHIFT.LCLK
LDIN1: U13.3(AIN) ; port HVSHIFT.LDIN1
LDIN2: U13.14(FIN) ; port HVSHIFT.LDIN2

### Notes on the sheet
- Labels drawn without touching a wire or pin: H*BL, H*LE, H*POL, HCLK, HDIN1, HDIN2

### Library data of the parts
C40 C41 C42#1 C43#1 = MT18B104K500CT: as C2 on sheet FPGA; Dielectric: X7R; Tolerance: 10%
  C42#1 C43#1: Supplier: Mouser
R39#1 R40#1 R41#1 R42 R43#1 R44#1 = CRGP1206F15K: 15 kOhms ±1% 0.5W, 1/2W Chip Resistor 1206 (3216 Metric) Automotive AEC-Q200, Pulse Withstanding Thick Film; Power Rating: 500mW; Resistance: 15k; Temperature Coefficient: 100ppm/c; Case Code: 1206
U13 = MC14504B: Voltage Level Translator Unidirectional 1 Circuit 6 Channel 16-SOIC
U17 U18 = HV5530PG-G: Shift Shift Register 1 Element 32 Bit 44-PQFP (10x10)

## Sheet MCU.SchDoc
size B; SheetNumber: 5; SheetTotal: 5
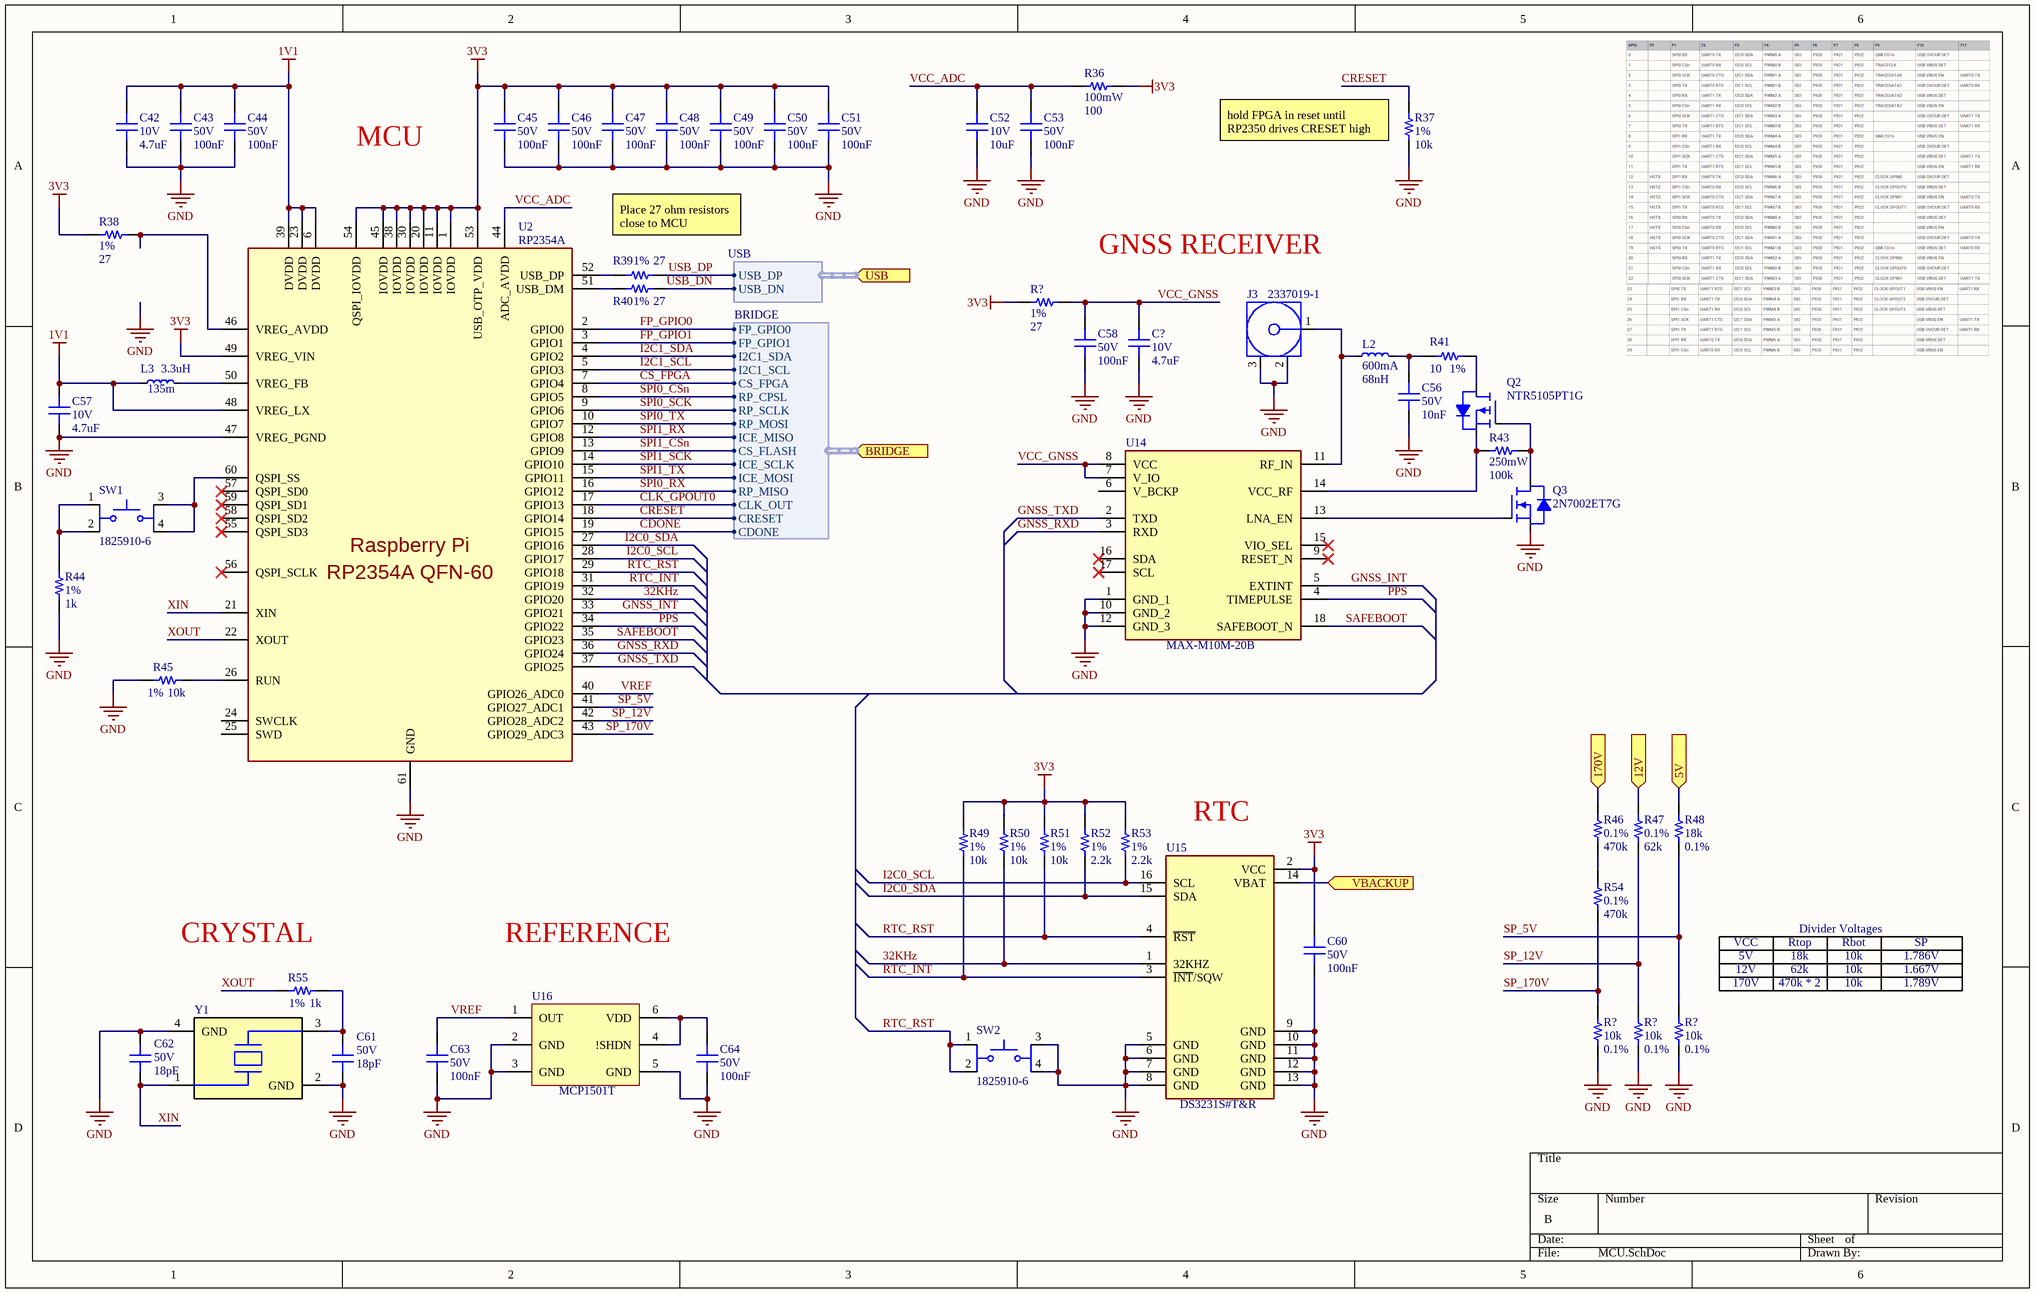
[diagram p4: MCU.SchDoc]

### Parts
(Parts that share a designator on the sheet are numbered #1, #2 ... from top to bottom, then left to right.)
C42#2  Voltage Rating: 10V  Capacitance: 4.7uF  [0603]  (hidden comment: CL10A475KP8NNNC)
C43#2  Voltage Rating: 50V  Capacitance: 100nF  [0603]  (hidden comment: MT18B104K500CT)
C44  Voltage Rating: 50V  Capacitance: 100nF  [0603]  (hidden comment: MT18B104K500CT)
C45  Voltage Rating: 50V  Capacitance: 100nF  [0603]  (hidden comment: MT18B104K500CT)
C46  Voltage Rating: 50V  Capacitance: 100nF  [0603]  (hidden comment: MT18B104K500CT)
C47  Voltage Rating: 50V  Capacitance: 100nF  [0603]  (hidden comment: MT18B104K500CT)
C48  Voltage Rating: 50V  Capacitance: 100nF  [0603]  (hidden comment: MT18B104K500CT)
C49  Voltage Rating: 50V  Capacitance: 100nF  [0603]  (hidden comment: MT18B104K500CT)
C50  Voltage Rating: 50V  Capacitance: 100nF  [0603]  (hidden comment: MT18B104K500CT)
C51  Voltage Rating: 50V  Capacitance: 100nF  [0603]  (hidden comment: MT18B104K500CT)
C52  Voltage Rating: 10V  Capacitance: 10uF  [0603]  (hidden comment: 0603X106M100CT)
C53  Voltage Rating: 50V  Capacitance: 100nF  [0603]  (hidden comment: MT18B104K500CT)
C56  Voltage Rating: 50V  Capacitance: 10nF  [0603]  (hidden comment: CL10B103KB8NNNL)
C57  Voltage Rating: 10V  Capacitance: 4.7uF  [0603]  (hidden comment: CL10A475KP8NNNC)
C58  Voltage Rating: 50V  Capacitance: 100nF  [0603]  (hidden comment: MT18B104K500CT)
C60  Voltage Rating: 50V  Capacitance: 100nF  [0603]  (hidden comment: MT18B104K500CT)
C61  Voltage Rating: 50V  Capacitance: 18pF  [0603]  (hidden comment: VJ0603A180FXXPW1BC)
C62  Voltage Rating: 50V  Capacitance: 18pF  [0603]  (hidden comment: VJ0603A180FXXPW1BC)
C63  Voltage Rating: 50V  Capacitance: 100nF  [0603]  (hidden comment: MT18B104K500CT)
C64  Voltage Rating: 50V  Capacitance: 100nF  [0603]  (hidden comment: MT18B104K500CT)
C?  Voltage Rating: 10V  Capacitance: 4.7uF  [0603]  (hidden comment: CL10A475KP8NNNC)
J3  2337019-1  [2337019-1]
L2  Avg Current: 600mA  Inductance: 68nH  (hidden comment: LQW18AS68NG0CD)
L3  Resistance: 135m  Inductance: 3.3uH  [1008]  (hidden comment: MPIA2512V3-3R3-R)
Q2  NTR5105PT1G  [SOT-23-3]
Q3  2N7002ET7G  [SOT-23-3]
R36  Power Rating: 100mW  Resistance: 100  [0603]  (hidden comment: CRG0603F100R)
R37  Tolerance: 1%  Resistance: 10k  [0603]  (hidden comment: CRG0603F10K)
R38  Tolerance: 1%  Resistance: 27  [0603]  (hidden comment: CRGP0603F27R)
R39#2  Tolerance: 1%  Resistance: 27  [0603]  (hidden comment: CRGP0603F27R)
R40#2  Tolerance: 1%  Resistance: 27  [0603]  (hidden comment: CRGP0603F27R)
R41#2  Tolerance: 1%  Resistance: 10  [0603]  (hidden comment: CRGCQ0603F10R)
R43#2  Power Rating: 250mW  Resistance: 100k  [0603]  (hidden comment: CRGP0603F100K)
R44#2  Tolerance: 1%  Resistance: 1k  [0603]  (hidden comment: CRGP0603F1K0)
R45  Tolerance: 1%  Resistance: 10k  [0603]  (hidden comment: CRG0603F10K)
R46  Tolerance: 0.1%  Resistance: 470k  [0805]  (hidden comment: CPF0805B470KE1)
R47  Tolerance: 0.1%  Resistance: 62k  [0603]  (hidden comment: CPF0603B62KE1)
R48  Resistance: 18k  Tolerance: 0.1%  [0603]  (hidden comment: CPF0603B18KE1)
R49  Tolerance: 1%  Resistance: 10k  [0603]  (hidden comment: CRG0603F10K)
R50  Tolerance: 1%  Resistance: 10k  [0603]  (hidden comment: CRG0603F10K)
R51  Tolerance: 1%  Resistance: 10k  [0603]  (hidden comment: CRG0603F10K)
R52  Tolerance: 1%  Resistance: 2.2k  [0603]  (hidden comment: CRGCQ0603F2K2)
R53  Tolerance: 1%  Resistance: 2.2k  [0603]  (hidden comment: CRGCQ0603F2K2)
R54  Tolerance: 0.1%  Resistance: 470k  [0805]  (hidden comment: CPF0805B470KE1)
R55  Tolerance: 1%  Resistance: 1k  [0603]  (hidden comment: CRGP0603F1K0)
R?#3  Tolerance: 1%  Resistance: 27  [0603]  (hidden comment: CRGP0603F27R)
R?#4  Resistance: 10k  Tolerance: 0.1%  [0603]  (hidden comment: CPF0603B10KE)
R?#5  Resistance: 10k  Tolerance: 0.1%  [0603]  (hidden comment: CPF0603B10KE)
R?#6  Resistance: 10k  Tolerance: 0.1%  [0603]  (hidden comment: CPF0603B10KE)
SW1  1825910-6
SW2  1825910-6
U2  RP2354A  [QFN-60]
U14#2  MAX-M10M-20B  [MAX-M10M-20B]
U15#2  DS3231S#T&R  [SOIC-16 WIDE]
U16#2  MCP1501T  [SOT-23-6]
Y1  RH100-12.000-12-1010-X-TR-NS2  (value not drawn)

### Ports
5V (in, see Top Sheet[2C], Power[4A]), 12V (in, see Top Sheet[2C], Power[5B]), 170V (in, see Top Sheet[2C], Power[5C]), BRIDGE (in, harness BRIDGE, see Top Sheet[1C], FPGA[2B]), USB (in, harness USB, see Top Sheet[2C], Power[1B]), VBACKUP (in)

### Harnesses
BRIDGE: CS_FPGA, ICE_SCLK, ICE_MOSI, ICE_MISO, CDONE, CRESET, FP_GPIO1, FP_GPIO0, CS_FLASH, RP_SCLK, RP_MOSI, RP_MISO, RP_CPSL, CLK_OUT, I2C1_SCL, I2C1_SDA
USB: USB_DP, USB_DN

### Nets
1V1: C42#2.2 C43#2.2 C44.2 C57.2 L3.1 U2.6(DVDD) U2.23(DVDD) U2.39(DVDD) U2.48(VREG_LX)
3V3: C45.2 C46.2 C47.2 C48.2 C49.2 C50.2 C51.2 C60.2 R36.2 R38.2 R49.1 R50.1 R51.1 R52.2 R53.2 R?#3.2 U2.1(IOVDD) U2.11(IOVDD) U2.20(IOVDD) U2.30(IOVDD) U2.38(IOVDD) U2.45(IOVDD) U2.49(VREG_VIN) U2.53(USB_OTP_VDD) U2.54(QSPI_IOVDD) U15#2.2(VCC)
12V: R47.2 ; port 12V
GND: C42#2.1 C43#2.1 C44.1 C45.1 C46.1 C47.1 C48.1 C49.1 C50.1 C51.1 C52.1 C53.1 C56.1 C57.1 C58.1 C60.1 C61.1 C62.2 C63.1 C64.1 C?.1 J3.2(GND) J3.3(GND) Q3.2(S) R37.2 R44#2.1 R45.2 R?#4.1 R?#5.1 R?#6.1 SW2.3 SW2.4 U2.47(VREG_PGND) U2.61(GND) U14#2.1(GND_1) U14#2.10(GND_2) U14#2.12(GND_3) U15#2.5(GND) U15#2.6(GND) U15#2.7(GND) U15#2.8(GND) U15#2.9(GND) U15#2.10(GND) U15#2.11(GND) U15#2.12(GND) U15#2.13(GND) U16#2.2(GND) U16#2.3(GND) U16#2.5(GND) Y1.2(GND) Y1.4(GND)
32KHz: R50.2 U2.32(GPIO20) U15#2.1(32KHZ)
CDONE: U2.19(GPIO15) ; port BRIDGE.CDONE
CLK_GPOUT0: U2.17(GPIO13) ; port BRIDGE.CLK_OUT
CRESET: R37.1 U2.18(GPIO14) ; port BRIDGE.CRESET
CS_FPGA: U2.7(GPIO4) ; port BRIDGE.CS_FPGA
FP_GPIO0: U2.2(GPIO0) ; port BRIDGE.FP_GPIO0
FP_GPIO1: U2.3(GPIO1) ; port BRIDGE.FP_GPIO1
GNSS_INT: U2.33(GPIO21) U14#2.5(EXTINT)
GNSS_RXD: U2.36(GPIO24) U14#2.3(RXD)
GNSS_TXD: U2.37(GPIO25) U14#2.2(TXD)
I2C0_SCL: R53.1 U2.28(GPIO17) U15#2.16(SCL)
I2C0_SDA: R52.1 U2.27(GPIO16) U15#2.15(SDA)
I2C1_SCL: U2.5(GPIO3) ; port BRIDGE.I2C1_SCL
I2C1_SDA: U2.4(GPIO2) ; port BRIDGE.I2C1_SDA
PPS: U2.34(GPIO22) U14#2.4(TIMEPULSE)
RTC_INT: R49.2 U2.31(GPIO19) U15#2.3(~{INT}/SQW)
RTC_RST: R51.2 SW2.1 SW2.2 U2.29(GPIO18) U15#2.4(~{RST})
SAFEBOOT: U2.35(GPIO23) U14#2.18(SAFEBOOT_N)
SP_5V: R48.1 R?#6.2 U2.41(GPIO27_ADC1)
SP_12V: R47.1 R?#5.2 U2.42(GPIO28_ADC2)
SP_170V: R54.1 R?#4.2 U2.43(GPIO29_ADC3)
SPI0_CSn: U2.8(GPIO5) ; port BRIDGE.RP_CPSL  [project net RP_CPSL]
SPI0_RX: U2.16(GPIO12) ; port BRIDGE.RP_MISO  [project net RP_MISO]
SPI0_SCK: U2.9(GPIO6) ; port BRIDGE.RP_SCLK  [project net RP_SCLK]
SPI0_TX: U2.10(GPIO7) ; port BRIDGE.RP_MOSI  [project net RP_MOSI]
SPI1_CSn: U2.13(GPIO9) ; port BRIDGE.CS_FLASH  [project net CS_FLASH]
SPI1_RX: U2.12(GPIO8) ; port BRIDGE.ICE_MISO  [project net ICE_MISO]
SPI1_SCK: U2.14(GPIO10) ; port BRIDGE.ICE_SCLK  [project net ICE_SCLK]
SPI1_TX: U2.15(GPIO11) ; port BRIDGE.ICE_MOSI  [project net ICE_MOSI]
USB_DN: R40#2.2 ; port USB.USB_DN
USB_DP: R39#2.2 ; port USB.USB_DP
VBUS: R48.2 ; port 5V
VCC_ADC: C52.2 C53.2 R36.1 U2.44(ADC_AVDD)
VCC_GNSS: C58.2 C?.2 R?#3.1 U14#2.7(V_IO) U14#2.8(VCC)
VREF: C63.2 U2.40(GPIO26_ADC0) U16#2.1(OUT)
XIN: C62.1 U2.21(XIN) Y1.1
XOUT: R55.2 U2.22(XOUT)
NetC33_2: R46.2 ; port 170V
NetC56_2: C56.2 L2.1 R41#2.1
NetC61_2: C61.2 R55.1 Y1.3
NetC64_2: C64.2 U16#2.4(!SHDN) U16#2.6(VDD)
NetJ3_1: J3.1(SIGNAL) L2.2 U14#2.11(RF_IN)
NetL3_2: L3.2 U2.50(VREG_FB)
NetQ2_1: Q2.1(G) Q3.3(D) R43#2.2
NetQ2_2: Q2.2(S) R43#2.1 U14#2.14(VCC_RF)
NetQ2_3: Q2.3(D) R41#2.2
NetQ3_1: Q3.1(G) U14#2.13(LNA_EN)
NetR38_1: R38.1 U2.46(VREG_AVDD)
NetR39#2_1: R39#2.1 U2.52(USB_DP)
NetR40#2_1: R40#2.1 U2.51(USB_DM)
NetR44#2_2: R44#2.2 SW1.1 SW1.2
NetR45_1: R45.1 U2.26(RUN)
NetR46_1: R46.1 R54.2
NetSW1_3: SW1.3 SW1.4 U2.60(QSPI_SS)
NetU15#2_14: U15#2.14(VBAT) ; port VBACKUP

Not connected (* = marked no-connect by the designer): U2 24(SWCLK) 25(SWD) 55(QSPI_SD3)* 56(QSPI_SCLK)* 57(QSPI_SD0)* 58(QSPI_SD2)* 59(QSPI_SD1)*; U14#2 6(V_BCKP) 9(RESET_N)* 15(VIO_SEL)* 16(SDA)* 17(SCL)*

### Notes on the sheet
- MCU
- (near R37) hold FPGA in reset until RP2350 drives CRESET high
- Place 27 ohm resistors close to MCU
- GNSS RECEIVER
- (near U15#2) RTC
- (near R55) CRYSTAL
- REFERENCE
- VCC
- 5V
- 12V
- Rtop
- 18k
- 62k
- Divider Voltages
- Rbot
- 10k
- SP
- 1.786V
- 1.667V
- 170V
- 470k * 2
- 1.789V
- (in symbol RP2354A) Raspberry Pi; RP2354A QFN-60

### Library data of the parts
C42#2 C57 C? = CL10A475KP8NNNC: as C19 on sheet Power; Dielectric: X5R; Tolerance: 10%
C43#2 C44-C51 C53 C58 C60 C63 C64 = MT18B104K500CT: as C2 on sheet FPGA; Dielectric: X7R; Tolerance: 10%
C52 = 0603X106M100CT: as C11 on sheet FPGA; Dielectric: X5R; Tolerance: 20%
C56 = CL10B103KB8NNNL: 10000 pF ±10% 50V Ceramic Capacitor X7R 0603 (1608 Metric); Tolerance: 10%; Dielectric: X7R
C61 C62 = VJ0603A180FXXPW1BC: 18 pF ±1% 25V Ceramic Capacitor C0G, NP0 0603 (1608 Metric); Dielectric: C0G (NP0); Tolerance: 1%
J3 = 2337019-1: U.FL (UMCC) Connector Receptacle, Male Pin 50 Ohms Surface Mount Solder
L2 = LQW18AS68NG0CD: Resistance: 340m
L3 = MPIA2512V3-3R3-R: 3.3 µH Shielded Molded Inductor 1.8 A 135mOhm Max 1008 (2520 Metric); Sat Current: 2.8A; Avg Current: 1.8A
Q2 = NTR5105PT1G: P-Channel 60 V 196mA (Ta) 347mW (Ta) Surface Mount SOT-23-3 (TO-236)
Q3 = 2N7002ET7G: N-Channel 60 V 260mA (Ta) 300mW (Tj) Surface Mount SOT-23-3 (TO-236)
R36 = CRG0603F100R: as R1 on sheet FPGA; Tolerance: 1%; Case Code: 0603
R37 R45 R49-R51 = CRG0603F10K: as R3 on sheet FPGA; Case Code: 0603
R38 R39#2 R40#2 R?#3 = CRGP0603F27R: 27 Ohms ±1% 0.25W, 1/4W Chip Resistor 0603 (1608 Metric) Automotive AEC-Q200, Pulse Withstanding Thick Film; Power Rating: 100mW; Temperature Coefficient: 100ppm/c; Case Code: 0603
R41#2 = CRGCQ0603F10R: 10 Ohms ±1% 0.1W, 1/10W Chip Resistor 0603 (1608 Metric) Automotive AEC-Q200, Moisture Resistant Thick Film; Power Rating: 100mW; Temperature Coefficient: 400ppm/c; Case Code: 0603
R43#2 = CRGP0603F100K: as R21 on sheet Power; Case Code: 0603; Tolerance: 1%
R44#2 R55 = CRGP0603F1K0: 1 kOhms ±1% 0.25W, 1/4W Chip Resistor 0603 (1608 Metric) Automotive AEC-Q200, Pulse Withstanding Thick Film; Power Rating: 250mW; Temperature Coefficient: 100ppm/c; Case Code: 0603
R46 R54 = CPF0805B470KE1: 470 kOhms ±0.1% 0.1W, 1/10W Chip Resistor 0805 (2012 Metric) Thin Film; Power Rating: 62.5mW; Temperature Coefficient: 25ppm/c; Case Code: 0805
R47 = CPF0603B62KE1: as R7 on sheet FPGA; Case Code: 0603
R48 = CPF0603B18KE1: 18 kOhms ±0.1% 0.063W, 1/16W Chip Resistor 0603 (1608 Metric) Thin Film; Power Rating: 62.5mW; Temperature Coefficient: 25ppm/c; Case Code: 0603
R52 R53 = CRGCQ0603F2K2: 2.2 kOhms ±1% 0.1W, 1/10W Chip Resistor 0603 (1608 Metric) Automotive AEC-Q200, Moisture Resistant Thick Film; Power Rating: 100mW; Temperature Coefficient: 100ppm/c; Case Code: 0603
R?#4-R?#6 = CPF0603B10KE: 10 kOhms ±0.1% 0.063W, 1/16W Chip Resistor 0603 (1608 Metric) Thin Film; Temperature Coefficient: 25ppm/c; Power Rating: 62.5mW; Case Code: 0603
SW1 SW2 = 1825910-6: Tactile Switch SPST-NO Top Actuated Through Hole
U2 = RP2354A: ARM Microcontrollers - 150MHz clock Dual Arm Cortex-M33 cores 520KB RAM 8KB on-chip OTP storage 7" Reel QFN-60
U14#2 = MAX-M10M-20B: RF Receiver BeiDou, Galileo, GLONASS, GNSS, GPS, QZSS, SBAS -165dBm 921.6kbps Not Included
U15#2 = DS3231S#T&R: Real Time Clock (RTC) IC Clock/Calendar I2C, 2-Wire Serial 16-SOIC (0.295", 7.50mm Width)
U16#2 = MCP1501T: Series Voltage Reference IC Fixed 2.048V V ±0.1% 20 mA SOT-23-6
Y1 = RH100-12.000-12-1010-X-TR-NS2: 12 MHz ±10ppm Crystal 12pF 50 Ohms 4-SMD, No Lead

## Nets that join several sheets
3V3: FPGA (13 pins), Power (7 pins), Nixie (C41.1 U13.1), MCU (26 pins)
12V: Power (7 pins), Nixie (C40.1 U13.16), MCU (R47.2)
GND: FPGA (23 pins), Power (49 pins), Nixie (C40.2 C41.2 U13.8 U13.13), MCU (51 pins)
VCC_1: FPGA (7 pins), Power (C25.2 U7.5)
CC1: FPGA (U3#1.2), Power (D?#2.1 J2.A5 R?#1.2)
CC2: FPGA (U4.6), Power (D?#2.3 J2.B5 R?#2.2)
CDONE: FPGA (U1.7), MCU (U2.19)
CLK_GPOUT0: FPGA (U1.20), MCU (U2.17)
CRESET: FPGA (U1.8), MCU (R37.1 U2.18)
CS_FLASH: FPGA (J1.1 R12.1 U1.16 U5.1), MCU (U2.13)
CS_FPGA: FPGA (U1.12), MCU (U2.7)
FP_GPIO0: FPGA (U1.6), MCU (U2.2)
FP_GPIO1: FPGA (U1.9), MCU (U2.3)
I2C1_SCL: FPGA (U1.11), MCU (U2.5)
I2C1_SDA: FPGA (U1.10), MCU (U2.4)
ICE_MISO: FPGA (J1.5 U1.17 U5.2), MCU (U2.12)
ICE_MOSI: FPGA (J1.2 U1.14 U5.5), MCU (U2.15)
ICE_SCLK: FPGA (R11.1 U1.15 U5.6), MCU (U2.14)
L*BL: FPGA (U1.23), Nixie (U13.5)
L*LE: FPGA (U1.27), Nixie (U13.7)
L*POL: FPGA (U1.26), Nixie (U13.9)
LCLK: FPGA (U1.28), Nixie (U13.11)
LDIN1: FPGA (U1.25), Nixie (U13.3)
LDIN2: FPGA (U1.31), Nixie (U13.14)
NetC33_2: Power (C33.2 C34.2 D2.1 R26.2), MCU (R46.2)
NetR27_2: FPGA (U1.46), Power (R27.2 U9.3)
NetR35_1: FPGA (U1.47), Power (R35.1)
NetU1_45: FPGA (U1.45), Power (U10.6)
NetU1_48: FPGA (U1.48), Power (U12.1)
RP_CPSL: FPGA (U1.21), MCU (U2.8)
RP_MISO: FPGA (U1.13), MCU (U2.16)
RP_MOSI: FPGA (U1.18), MCU (U2.10)
RP_SCLK: FPGA (U1.19), MCU (U2.9)
USB_DN: Power (D?#2.6 J2.A7 J2.B7), MCU (R40#2.2)
USB_DP: Power (D?#2.4 J2.A6 J2.B6), MCU (R39#2.2)
VBUS: FPGA (C14.1 R7.2 U3#1.8), Power (10 pins), MCU (R48.2)